# EAGLE schematic Spring12_6_rev4 (EAGLE 6.1)
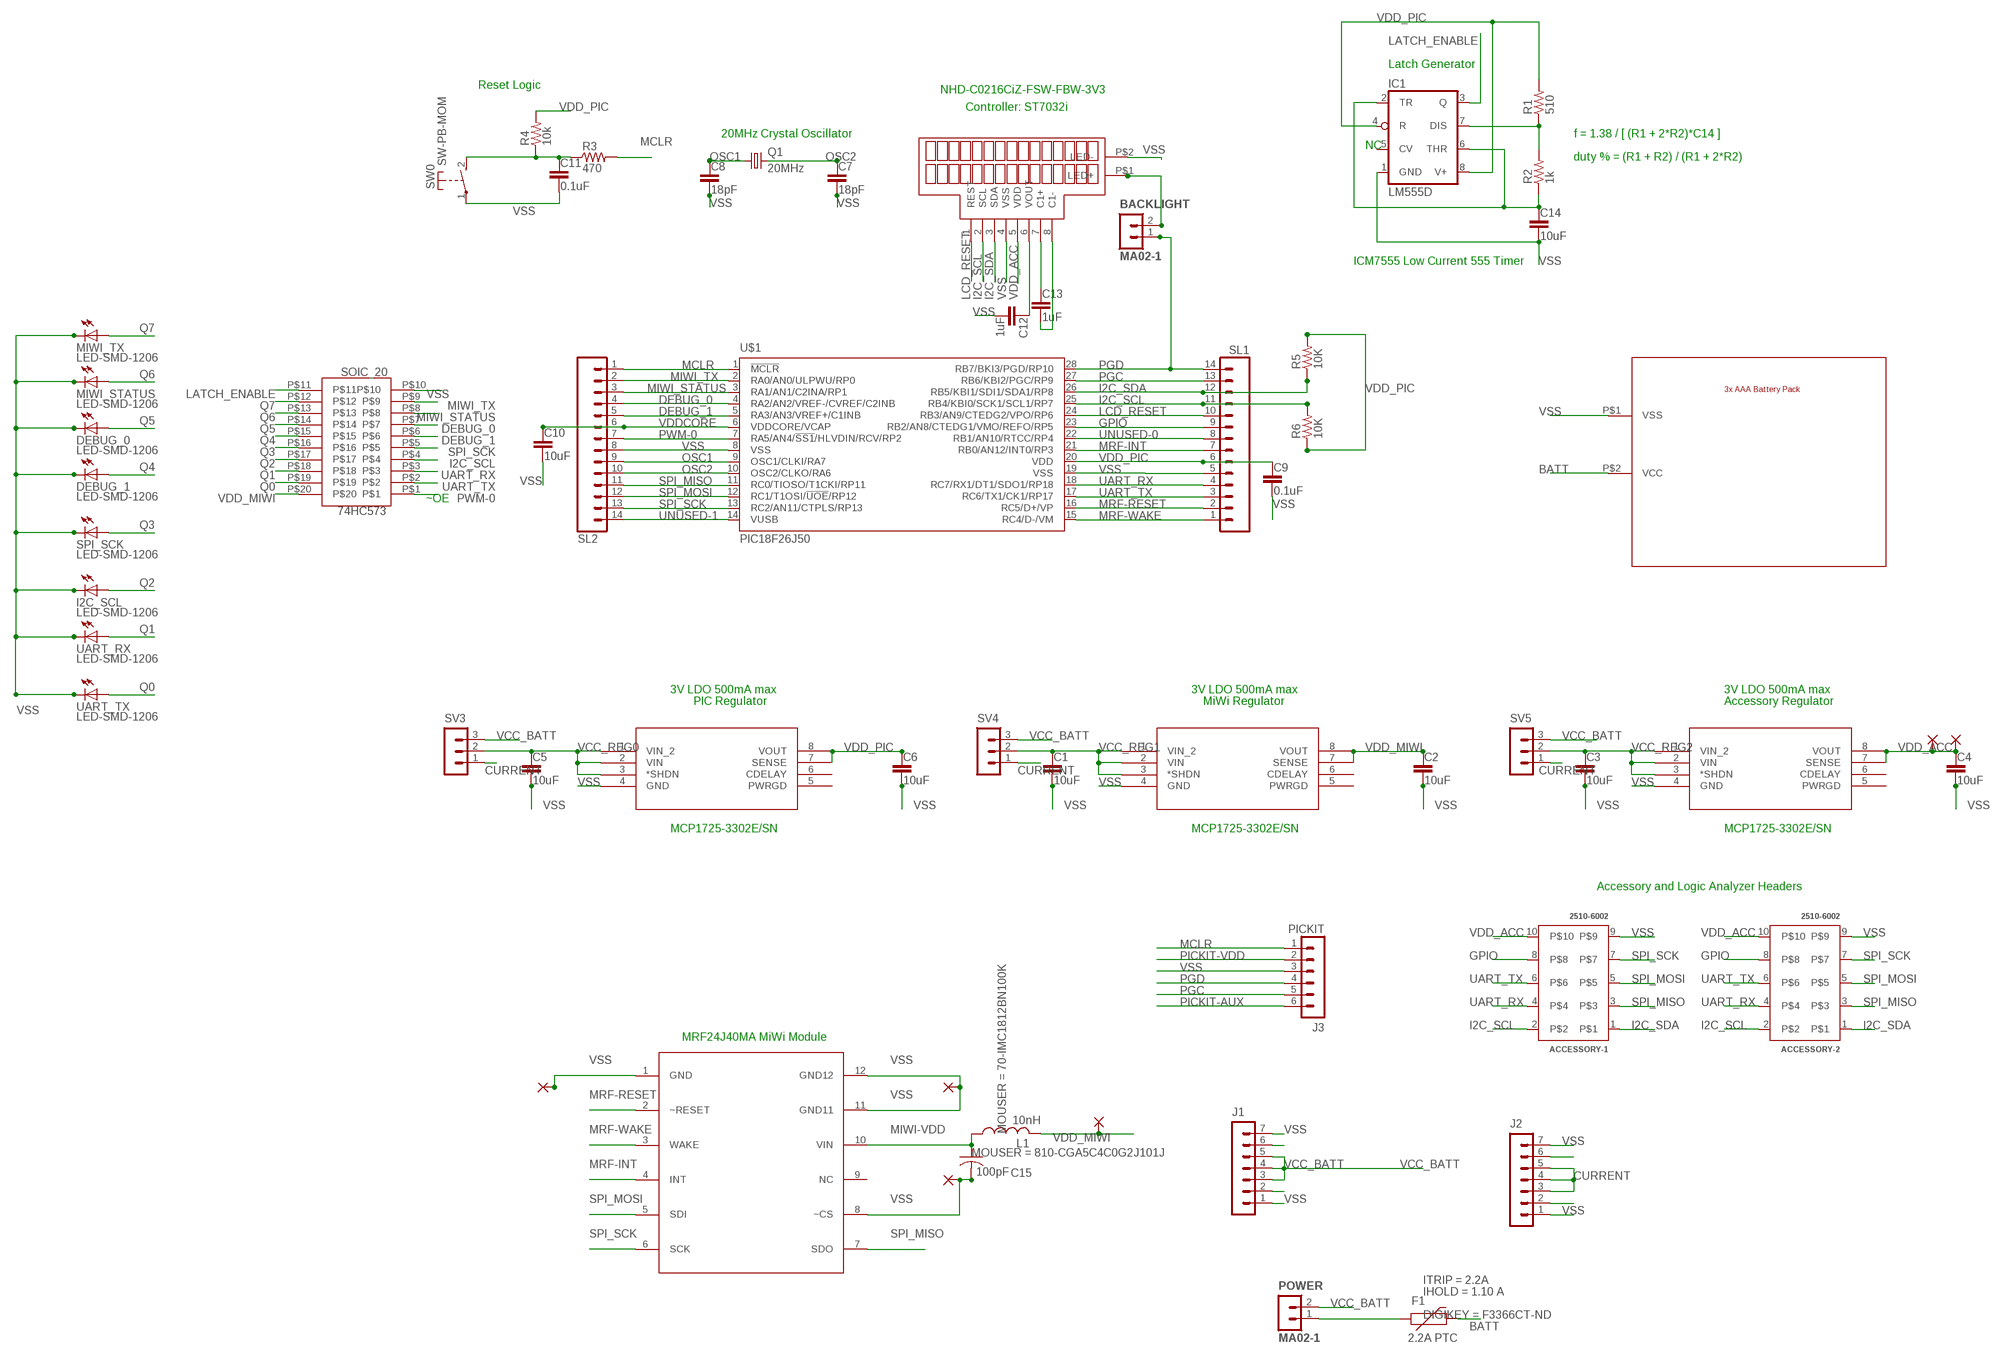
[diagram p0: schematic, sheet 1]

## Parts
74HC573  SOIC_20  [SO20W]
ACCESSORY-1  2510-6002  [2510-6002]
ACCESSORY-2  2510-6002  [2510-6002]
BACKLIGHT  MA02-1  [MA02-1]
BATT0  2479-BATTERY  [2479-BATTERY]
C1  10uF  C2.5-5  [C2.5-5]
C2  10uF  C2.5-5  [C2.5-5]
C3  10uF  C2.5-5  [C2.5-5]
C4  10uF  C2.5-5  [C2.5-5]
C5  10uF  C2.5-5  [C2.5-5]
C6  10uF  C2.5-5  [C2.5-5]
C7  18pF  C2.5-5  [C2.5-5]
C8  18pF  C2.5-5  [C2.5-5]
C9  0.1uF  C2.5-5  [C2.5-5]
C10  10uF  C2.5-5  [C2.5-5]
C11  0.1uF  C2.5-5  [C2.5-5]
C12  1uF  C2.5-5  [C2.5-5]
C13  1uF  C2.5-5  [C2.5-5]
C14  10uF  C2.5-5  [C2.5-5]
C15  100pF  C-USC1206  [C1206]
DEBUG_0  LED-SMD-1206  [LED1206]
DEBUG_1  LED-SMD-1206  [LED1206]
F1  2.2A PTC  PTCSMD  [PTC-1206]
I2C_SCL  LED-SMD-1206  [LED1206]
IC1  LM555D  [SO08]
J1  MA07-1  [MA07-1]
J2  MA07-1  [MA07-1]
J3  PICKIT  MA06-1  [MA06-1]
L1  10nH  L-USL1812  [L1812]
MIWI_STATUS  LED-SMD-1206  [LED1206]
MIWI_TX  LED-SMD-1206  [LED1206]
POWER  MA02-1  [MA02-1]
Q1  20MHz  CRYSTALHC49U-V  [HC49U-V]
R1  510  R1206  [R1206]
R2  1k  R1206  [R1206]
R3  470  R1206  [R1206]
R4  10k  R1206  [R1206]
R5  10K  R1206  [R1206]
R6  10K  R1206  [R1206]
REG0  MCP1725-XXXXX/SN  [SOIC8-N_MC]
REG1  MCP1725-XXXXX/SN  [SOIC8-N_MC]
REG2  MCP1725-XXXXX/SN  [SOIC8-N_MC]
RF0  MRF24J40MA  [PCB12]
SL1  M14  [14P]
SL2  M14  [14P]
SPI_SCK  LED-SMD-1206  [LED1206]
SV3  MA03-1  [MA03-1]
SV4  MA03-1  [MA03-1]
SV5  MA03-1  [MA03-1]
SW0  SW-PB-MOM  [SW-MOM-PB]
U$1  PIC18F26J50  [DIL28-3]
U$2  NHD-C0216CIZ-FSW-FBW-3V3  NHD-C0216CIZ-FN-FBW-3V  [SIL8-1.5]
U$3  VIA  [VIA]
U$4  VIA  [VIA]
U$5  VIA  [VIA]
U$18  VIA  [VIA]
U$19  VIA  [VIA]
U$20  VIA  [VIA]
UART_RX  LED-SMD-1206  [LED1206]
UART_TX  LED-SMD-1206  [LED1206]

## Nets
BATT: BATT0.P$2(VCC) F1.2
CURRENT: J2.3 J2.4 J2.5 SV3.1 SV4.1 SV5.1
DEBUG_0: 74HC573.P$7 SL2.4 U$1.4(RA2/AN2/VREF-/CVREF/C2INB)
DEBUG_1: 74HC573.P$6 SL2.5 U$1.5(RA3/AN3/VREF+/C1INB)
GPIO: ACCESSORY-1.8 ACCESSORY-2.8 SL1.9 U$1.23(RB2/AN8/CTEDG1/VMO/REFO/RP5)
I2C_SCL: 74HC573.P$4 ACCESSORY-1.2 ACCESSORY-2.2 R6.2 SL1.11 U$1.25(RB4/KBI0/SCK1/SCL1/RP7) U$2.2(SCL)
I2C_SDA: ACCESSORY-1.1 ACCESSORY-2.1 R5.1 SL1.12 U$1.26(RB5/KBI1/SDI1/SDA1/RP8) U$2.3(SDA)
LATCH_ENABLE: 74HC573.P$11 IC1.3(Q)
LCD_RESET: SL1.10 U$1.24(RB3/AN9/CTEDG2/VPO/RP6) U$2.1(REST)
MCLR: J3.1 R3.2 SL2.1 U$1.1(!MCLR)
MIWI-VDD: C15.1 L1.1 RF0.10(VIN)
MIWI_STATUS: 74HC573.P$8 SL2.3 U$1.3(RA1/AN1/C2INA/RP1)
MIWI_TX: 74HC573.P$9 SL2.2 U$1.2(RA0/AN0/ULPWU/RP0)
MRF-INT: RF0.4(INT) SL1.7 U$1.21(RB0/AN12/INT0/RP3)
MRF-RESET: RF0.2(~RESET) SL1.2 U$1.16(RC5/D+/VP)
MRF-WAKE: RF0.3(WAKE) SL1.1 U$1.15(RC4/D-/VM)
N$1: BACKLIGHT.2 U$2.P$1(LED+)
N$2: IC1.7(DIS) R1.1 R2.2
N$3: C14.1 IC1.2(TR) IC1.6(THR) R2.1
N$6: C11.1 R3.1 R4.1 SW0.2(S)
N$7: J1.6
N$8: C12.1 U$2.6(VOUT)
N$9: C13.1 U$2.7(C1+)
N$10: C13.2 U$2.8(C1-)
N$12: F1.1 POWER.1
N$14: J1.2
N$17: J2.6
N$21: J2.2
OSC1: C8.1 Q1.1 SL2.9 U$1.9(OSC1/CLKI/RA7)
OSC2: C7.1 Q1.2 SL2.10 U$1.10(OSC2/CLKO/RA6)
PGC: J3.5 SL1.13 U$1.27(RB6/KBI2/PGC/RP9)
PGD: BACKLIGHT.1 J3.4 SL1.14 U$1.28(RB7/BKI3/PGD/RP10)
PICKIT-AUX: J3.6
PICKIT-VDD: J3.2
PWM-0: 74HC573.P$1 SL2.7 U$1.7(RA5/AN4/!SS1!/HLVDIN/RCV/RP2)
Q0: 74HC573.P$19 UART_TX.A
Q1: 74HC573.P$18 UART_RX.A
Q2: 74HC573.P$17 I2C_SCL.A
Q3: 74HC573.P$16 SPI_SCK.A
Q4: 74HC573.P$15 DEBUG_1.A
Q5: 74HC573.P$14 DEBUG_0.A
Q6: 74HC573.P$13 MIWI_STATUS.A
Q7: 74HC573.P$12 MIWI_TX.A
SPI_MISO: ACCESSORY-1.3 ACCESSORY-2.3 RF0.7(SDO) SL2.11 U$1.11(RC0/TIOSO/T1CKI/RP11)
SPI_MOSI: ACCESSORY-1.5 ACCESSORY-2.5 RF0.5(SDI) SL2.12 U$1.12(RC1/T1OSI/!UOE!/RP12)
SPI_SCK: 74HC573.P$5 ACCESSORY-1.7 ACCESSORY-2.7 RF0.6(SCK) SL2.13 U$1.13(RC2/AN11/CTPLS/RP13)
UART_RX: 74HC573.P$3 ACCESSORY-1.4 ACCESSORY-2.4 SL1.4 U$1.18(RC7/RX1/DT1/SDO1/RP18)
UART_TX: 74HC573.P$2 ACCESSORY-1.6 ACCESSORY-2.6 SL1.3 U$1.17(RC6/TX1/CK1/RP17)
UNUSED-0: SL1.8 U$1.22(RB1/AN10/RTCC/RP4)
UNUSED-1: SL2.14 U$1.14(VUSB)
VCC_BATT: J1.3 J1.4 J1.5 POWER.2 SV3.3 SV4.3 SV5.3
VCC_REG0: C5.1 REG0.1(VIN_2) REG0.2(VIN) REG0.3(*SHDN) SV3.2
VCC_REG1: C1.1 REG1.1(VIN_2) REG1.2(VIN) REG1.3(*SHDN) SV4.2
VCC_REG2: C3.1 REG2.1(VIN_2) REG2.2(VIN) REG2.3(*SHDN) SV5.2
VDD_ACC: ACCESSORY-1.10 ACCESSORY-2.10 C4.1 REG2.7(SENSE) REG2.8(VOUT) U$2.5(VDD) U$3.1(P) U$4.1(P)
VDD_MIWI: 74HC573.P$20 C2.1 L1.2 REG1.7(SENSE) REG1.8(VOUT) U$5.1(P)
VDD_PIC: C6.1 C9.1 IC1.4(R) IC1.8(V+) R1.2 R4.2 R5.2 R6.1 REG0.7(SENSE) REG0.8(VOUT) SL1.6 U$1.20(VDD)
VDDCORE: C10.1 SL2.6 U$1.6(VDDCORE/VCAP)
VSS: 74HC573.P$10 ACCESSORY-1.9 ACCESSORY-2.9 BATT0.P$1(VSS) C1.2 C2.2 C3.2 C4.2 C5.2 C6.2 C7.2 C8.2 C9.2 C10.2 C11.2 C12.2 C14.2 C15.2 DEBUG_0.C DEBUG_1.C I2C_SCL.C IC1.1(GND) J1.1 J1.7 J2.1 J2.7 J3.3 MIWI_STATUS.C MIWI_TX.C REG0.4(GND) REG1.4(GND) REG2.4(GND) RF0.1(GND) RF0.8(~CS) RF0.11(GND11) RF0.12(GND12) SL1.5 SL2.8 SPI_SCK.C SW0.1(P) U$1.8(VSS) U$1.19(VSS) U$2.4(VSS) U$2.P$2(LED-) U$18.1(P) U$19.1(P) U$20.1(P) UART_RX.C UART_TX.C
Unconnected: IC1.5(CV) REG0.5(PWRGD) REG0.6(CDELAY) REG1.5(PWRGD) REG1.6(CDELAY) REG2.5(PWRGD) REG2.6(CDELAY) RF0.9(NC)

## Notes on the sheet
- Latch Generator
- Reset Logic
- NHD-C0216CiZ-FSW-FBW-3V3
- Controller: ST7032i
- 20MHz Crystal Oscillator | f = 1.38 / [ (R1 + 2*R2)*C14 ]
- NC
- duty % = (R1 + R2) / (R1 + 2*R2)
- ICM7555 Low Current 555 Timer
- ~OE
- 3V LDO 500mA max | 3V LDO 500mA max | 3V LDO 500mA max
- PIC Regulator | MiWi Regulator | Accessory Regulator
- MCP1725-3302E/SN | MCP1725-3302E/SN | MCP1725-3302E/SN
- Accessory and Logic Analyzer Headers
- MRF24J40MA MiWi Module

## Library data of the parts
74HC573 = SparkFun:SOIC_20
ACCESSORY-1 ACCESSORY-2 = 4534_I2C2:2510-6002: 3M 2510-6002 Walled Header
BACKLIGHT POWER = 4534:MA02-1: Male Header 0.040 drill
BATT0 = 4534_Node_Board:2479-BATTERY
C1-C7 C14 = 4534_I2C2:C2.5-5: CAPACITOR, 2.5 MM SPACING
C8-C13 = 4534_I2C2:C2.5-5: CAPACITOR, 2.5 MM SPACING; DIGIKEY: 490-3632-ND
C15 = rcl:C-US: CAPACITOR, American symbol; MOUSER: 810-CGA5C4C0G2J101J
DEBUG_0 DEBUG_1 I2C_SCL MIWI_STATUS MIWI_TX SPI_SCK UART_RX UART_TX = 4534_I2C2:LED-SMD-1206: 160-1169-1-ND
F1 = SparkFun:PTC: Resettable Fuse PTC Resettable Fuse. Spark Fun Electronics SKU : COM-08357; DIGIKEY: F3366CT-ND; IHOLD: 1.10 A; ITRIP: 2.2A
IC1 = 4534:*555: TIMER
J1 J2 = 4534:MA07-1: Male Header 0.040 drill
J3 = 4534:MA06-1: Male Header 0.040 drill
L1 = rcl:L-US: INDUCTOR, American symbol; MOUSER: 70-IMC1812BN100K
Q1 = crystal:CRYSTAL: CRYSTAL; DIGIKEY: XC1723-ND; OC_FARNELL: 1666969; OC_NEWARK: unknown
R1-R6 = 4534_I2C2:R1206: Surface mount resistor, 1206 package
REG0 REG1 REG2 = 4534_Node_Board:MCP1725-XXXXX/SN; NEWARK: MCP1725-3002E/SN
RF0 = 4534_Node_Board:MRF24J40MA
SL1 SL2 = con-amp-quick:M14: AMP QUICK CONNECTOR; OC_FARNELL: unknown; OC_NEWARK: unknown
SV3-SV5 = 4534:MA03-1: Male Header 0.040 drill; OC_FARNELL: unknown; OC_NEWARK: unknown
SW0 = 4534:SW-PB-MOM: Digi-Key P13589S-ND
U$1 = 4534:PIC18F26J50: 28 pin PIC with USB
U$2 = nhd-cog:NHD-C0216CIZ-FN-FBW-3V
U$3-U$5 U$18-U$20 = 4534_I2C2:VIA: connect top of board to bottom of board through a via